# Altium schematic sheet Power subsystem.SchDoc
size A; SheetNumber: 2; SheetTotal: 2
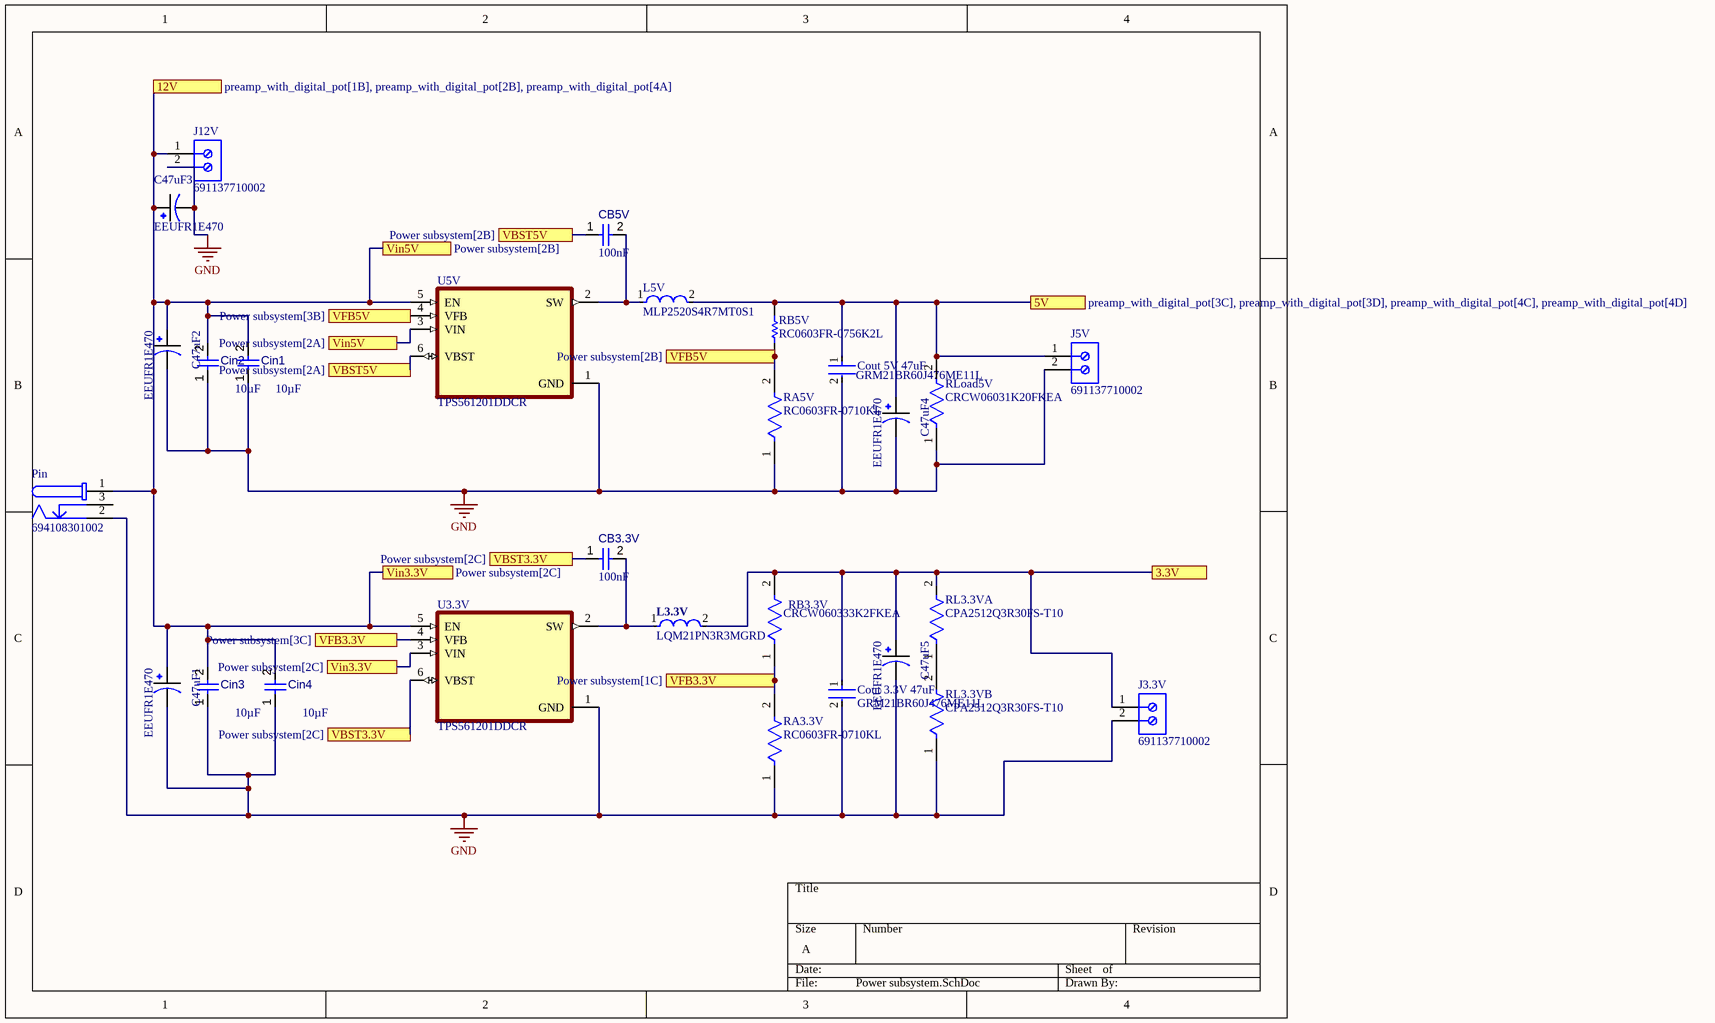
[diagram p0: Power subsystem.SchDoc]

## Parts
C47uF1  EEUFR1E470  [*CAPPRD200W50D500H1100_EEUFR1E470(Primary)]
C47uF2  EEUFR1E470  [*CAPPRD200W50D500H1100_EEUFR1E470(Primary)]
C47uF3  EEUFR1E470  [*CAPPRD200W50D500H1100_EEUFR1E470(Primary)]
C47uF4  EEUFR1E470  [*CAPPRD200W50D500H1100_EEUFR1E470(Primary)]
C47uF5  EEUFR1E470  [*CAPPRD200W50D500H1100_EEUFR1E470(Primary)]
CB3.3V  value 100nF  [CAPC1608X90X40NL10T20]  (hidden comment: Capacitor 100 nF +/-10% 50 V 0603)
CB5V  value 100nF  [CAPC1608X90X40NL10T20]  (hidden comment: Capacitor 100 nF +/-10% 50 V 0603)
Cin1  value 10µF  [CAPC0805(2012)145_L]  (hidden comment: Capacitor 10µF +/-20% 25V 0805)
Cin2  value 10µF  [CAPC0805(2012)145_L]  (hidden comment: Capacitor 10µF +/-20% 25V 0805)
Cin3  value 10µF  [CAPC0805(2012)145_L]  (hidden comment: Capacitor 10µF +/-20% 25V 0805)
Cin4  value 10µF  [CAPC0805(2012)145_L]  (hidden comment: Capacitor 10µF +/-20% 25V 0805)
Cout_3.3V_47uF  GRM21BR60J476ME11L  [FP-GRM21B-0_2-e0_2_0_7-IPC_B]
Cout_5V_47uF  GRM21BR60J476ME11L  [FP-GRM21B-0_2-e0_2_0_7-IPC_B]
J3.3V  691137710002  [691137710002]
J5V  691137710002  [691137710002]
J12V  691137710002  [691137710002]
L3.3V  LQM21PN3R3MGRD  [FP-LQM21PH_G0-MFG]
L5V  MLP2520S4R7MT0S1  [FP-MLP2520M-IPC_C]
Pin  694108301002  [694108301002]
RA3.3V  RC0603FR-0710KL  [FP-RC0603-0_55-IPC_C]
RA5V  RC0603FR-0710KL  [FP-RC0603-0_55-IPC_C]
RB3.3V  CRCW060333K2FKEA  [FP-CRCW0603-e3-IPC_B]
RB5V  RC0603FR-0756K2L  [RESC1608X55X25LL10T15]
RL3.3VA  CPA2512Q3R30FS-T10  [FP-CPA2512-MFG]
RL3.3VB  CPA2512Q3R30FS-T10  [FP-CPA2512-MFG]
RLoad5V  CRCW06031K20FKEA  [FP-CRCW0603-e3-MFG]
U3.3V  TPS561201DDCR  [SOT95P280X110-6N]
U5V  TPS561201DDCR  [SOT95P280X110-6N]

## Ports
3.3V, 5V (see preamp_with_digital_pot[3C], preamp_with_digital_pot[3D], preamp_with_digital_pot[4C], preamp_with_digital_pot[4D]), 12V (see preamp_with_digital_pot[1B], preamp_with_digital_pot[2B], preamp_with_digital_pot[4A]), VBST3.3V (see Power subsystem[2C]), VBST5V (see Power subsystem[2A]), VBST5V (see Power subsystem[2B]), VFB3.3V (see Power subsystem[1C]), VFB3.3V (see Power subsystem[3C]), VFB5V (see Power subsystem[2B]), VFB5V (see Power subsystem[3B]), Vin3.3V (see Power subsystem[2C]), Vin5V (see Power subsystem[2A]), Vin5V (see Power subsystem[2B])

## Nets
GND: C47uF1.N C47uF2.N C47uF3.N C47uF4.N C47uF5.N Cin1.1 Cin2.1 Cin3.1 Cin4.1 Cout_3.3V_47uF.2 Cout_5V_47uF.2 J3.3V.2 J5V.2 J12V.2 Pin.2 RA3.3V.1 RA5V.1 RL3.3VB.1 RLoad5V.1 U3.3V.1(GND) U5V.1(GND)
3.3V: C47uF5.P Cout_3.3V_47uF.1 J3.3V.1 L3.3V.2 RB3.3V.2 RL3.3VA.2 ; port 3.3V
5V: C47uF4.P Cout_5V_47uF.1 J5V.1 L5V.2 RB5V.2 RLoad5V.2 ; port 5V
12V: C47uF1.P C47uF2.P C47uF3.P Cin1.2 Cin2.2 Cin3.2 Cin4.2 J12V.1 Pin.1 U3.3V.3(VIN) U3.3V.5(EN) U5V.3(VIN) U5V.5(EN) ; port Vin5V, port Vin3.3V, port 12V
VBST3.3V: CB3.3V.1 U3.3V.6(VBST) ; port VBST3.3V
VBST5V: CB5V.1 U5V.6(VBST) ; port VBST5V
VFB3.3V: RA3.3V.2 RB3.3V.1 U3.3V.4(VFB) ; port VFB3.3V
VFB5V: RA5V.2 RB5V.1 U5V.4(VFB) ; port VFB5V
NetCB3.3V_2: CB3.3V.2 L3.3V.1 U3.3V.2(SW)
NetCB5V_2: CB5V.2 L5V.1 U5V.2(SW)
NetRL3.3VA_1: RL3.3VA.1 RL3.3VB.2

Not connected (* = marked no-connect by the designer): Pin 3

## Library data of the parts
CB3.3V CB5V = CMP-001-00017-6: Chip Capacitor, 100 nF, +/- 10%, 50 V, 0603 (1608 Metric); Voltage Rating: 50V; Capacitor Type: Ceramic; Tolerance: 10%; Mounting Technology: SM; Max Operating Temperature: 125°C; RoHS Compliant: True; Pins: 2; Case/Package: 0603; Min Operating Temperature: -55°C
Cin1-Cin4 = CMP-001-00079-4: Chip Capacitor, 10µF +/-20%, 25V, 0805, Thickness 1.45 mm; Tolerance: 10%; Max Operating Temperature: 85°C; Case/Package: 0805; Voltage Rating: 25V; Min Operating Temperature: -55°C; Mounting Technology: SMT; Pins: 2
Cout_3.3V_47uF Cout_5V_47uF = CMP-06035-028650-1: Chip Multilayer Ceramic Capacitors for General Purpose, 0805, 47uF, X5R, 15%, 20%, 6.3V; Tolerance: 20%; Case/Package: 0805; Length: 2mm; Thickness: 1.25mm; Dielectric: X5R; Width: 1.25mm; Capacitance: 47uF; Voltage Rating (DC): 6.3V
J3.3V J5V J12V = CMP-1502-03324-2: NexarPartId: 78871135; Voltage Rating: 300V; Number of Contacts: 2; Current Rating: 16A; Lead Pitch: 5mm; Height: 11.6mm; Packaging: Box; RoHS: Non-Compliant; Contact Material: Nickel, Tin; Max Operating Temperature: 120°C; Number of Pins: 2; Min Operating Temperature: -30°C; Number of Rows: 1
L3.3V = CMP-06042-017013-1: Multilayer Type Inductor for Power Lines, 0805 (2012), 3.3μH, 20%, 0.188Ω, 1.0A; Current Rating: 1A; DC Resistance (DCR): 188mR; Core Material: Ferrite; Shielding: Shielded; Self Resonant Frequency: 30MHz; Test Frequency: 1MHz; Inductance: 3.3uH; Max Operating Temperature: 125°C; Tolerance: 20%; Mount: Surface Mount; RoHS Compliant: Yes; Package Quantity: 4000; Height - Seated (Max): 0.039inch; Length: 0.079inch; Width: 0.049inch; Case/Package: 0805; Packaging: Tape and Reel; Min Operating Temperature: -55°C
L5V = CMP-08253-000319-1: Shielded Multilayer Inductor 4.7uH ±20% 1000mA 169mΩ SMD 1008; Test Frequency: 2MHz; DC Resistance (DCR): 169mR; Core Material: Ferrite; Current Rating: 1A; Max Operating Temperature: 125°C; Packaging: Tape and Reel; Length: 0.098inch; Shielding: Shielded; Height - Seated (Max): 0.039inch; Case Code (Imperial): 1008; Tolerance: 20%; Width: 0.079inch; Package Quantity: 3000; Case/Package: 1008; Case Code (Metric): 2520; RoHS Compliant: Yes; Mount: Surface Mount; Inductance: 4.7uH; Min Operating Temperature: -40°C
Pin = CMP-1502-00190-3: NexarPartId: 52676102; Gender: Male; Voltage Rating: 24V; Insulation Resistance: 100MΩ; Voltage Rating (DC): 20V; Shielding: Unshielded; Connector Type: Power; Current Rating: 5A; Number of Contacts: 3; Packaging: Bulk; Operating Supply Voltage: 24V; Flammability Rating: UL94 V-0; Housing Material: Polyamide; Color: Black; REACH SVHC: Unknown; Contact Material: Gold, Tin; Max Operating Temperature: 85°C; Contact Gender: Female; Contact Plating: Tin; Termination: Through Hole; Min Operating Temperature: -40°C; RoHS: Compliant; Height: 11mm; Mount: Through Hole
RA3.3V RA5V = CMP-2100-03664-2: RES 10K OHM 1% 1/10W 0603; Voltage Rating: 75V; Voltage Rating (DC): 50V; Resistance: 10kR; Power Rating: 100mW; Temperature Coefficient: 100ppm/°C; Depth: 0.8mm; Termination: SMD/SMT; Resistor Type: Thick Film; Series: RC; Construction: Rectangular; Features: Moisture Resistant; Packaging: Tape and Reel; Min Operating Temperature: -55°C; Number of Terminations: 2; Lead Pitch: 0.3mm; RoHS Compliant: Yes; Case/Package: 0603; Resistance Tolerance: 1%; Military Standard: Not; Weight: 7.1E-05oz; Number of Pins: 2; Tolerance: 1%; Length: 1.6mm; Case Code (Imperial): 0603; Lead Free: Lead Free; Width: 0.8mm; Max Power Dissipation: 100mW; Height: 0.45mm; Max Operating Temperature: 155°C; Case Code (Metric): 1608; Size Code: 0603
RB3.3V = CMP-2000-03248-2: RES Thick Film, 33.2kΩ, 1%, 0.1W, 100ppm/°C, 0603; Voltage Rating (DC): 75V; Max Power Dissipation: 100mW; Resistance: 33.2kR; Package Quantity: 5000; Max Operating Temperature: 155°C; Height: 0.45mm; Radiation Hardening: No; Width: 0.85mm; Termination: SMD/SMT; Weight: 7.1E-05oz; Number of Terminations: 2; Case Code (Imperial): 0603; Military Standard: Not; Temperature Coefficient: 100ppm/°C; Case/Package: 0603; Length: 1.55mm; Packaging: Tape and Reel; Number of Pins: 2; Lead Free: Lead Free; Composition: Thick Film; Case Code (Metric): 1608; Tolerance: 1%; Min Operating Temperature: -55°C; Voltage Rating: 75V; Depth: 0.85mm; Mount: Surface Mount; Contact Plating: Tin; Power Rating: 100mW; Features: Automotive AEC-Q200
RB5V = CMP-1659-00050-1: Chip Resistor, 56.2 KOhm, +/- 1%, 0.1 W, -55 to 155 degC, 0603 (1608 Metric), RoHS, Tape and Reel; Gender: Female; Connector Type: USB; Voltage Rating: 30 V; Current Rating: 1 A; Packaging: Tray; Package Quantity: 24000; PackageDescription: 2-Pin Surface Mount Device, Body 1.6 x 0.8 mm; DatasheetVersion: Rev. 4, 02/2016; PackageReference: 0603; Length: 14.5 mm; Contact Material: Copper; ComponentLink2Description: Datasheet; Radiation Hardening: No; Max Operating Temperature: 50 degC; Width: 7.12 mm; RoHSCompliant: true; Contact Plating: Gold; Pins: 4; Colour: Black; ComponentLink1Description: Manufacturer URL; Min Operating Temperature: 0 degC; ComponentLink2URL: http://www.yageo.com/documents/recent/PYu-RC_Group_51_RoHS_L_04.pdf; Height: 15 mm; ComponentLink1URL: http://www.yageo.com/; Mount: Through Hole; REACH SVHC: Unknown
RL3.3VA RL3.3VB = CMP-00597-19168341-1: CPA2512Q3R30FS-T10 CPA Series 2512 16 W 3.3O ±1% ±50 ppm/°C SMT Thin Film Chip Power Resistor; Max Power Dissipation: 16W; Resistance: 3.3Ω; Max Operating Temperature: 155°C; Features: Moisture Resistant; NexarPartId: 19168341; Composition: Thin Film; Power Rating: 16W; Width: 3.2mm; Packaging: Cut Tape (CT); Temperature Coefficient: 50ppm/°C; Height: 787.4µm; Number of Terminations: 2; Lifecycle Status: Production; Case Code (Metric): 6432; Length: 6.2992mm; Lead Free: Lead Free; Case/Package: 2512; RoHS: Compliant; Case Code (Imperial): 2512; Tolerance: 1%; Min Operating Temperature: -55°C
RLoad5V = CMP-2000-02982-2: RES Thick Film, 1.2kΩ, 1%, 0.1W, 100ppm/°C, 0603; Max Power Dissipation: 100mW; Resistance: 1.2kR; Voltage Rating: 75V; Package Quantity: 10; Weight: 7.1E-05oz; Packaging: Tape and Reel; Max Operating Temperature: 155°C; Case/Package: 0603; Case Code (Imperial): 0603; Length: 1.55mm; Width: 0.033inch; Radiation Hardening: No; Power Rating: 100mW; Depth: 0.85mm; Military Standard: Not; Case Code (Metric): 1608; Tolerance: 1%; Termination: SMD/SMT; Temperature Coefficient: 100ppm/°C; Mount: Surface Mount; Min Operating Temperature: -55°C; Lead Free: Lead Free; Contact Plating: Tin; Composition: Thick Film; Voltage Rating (DC): 75V; Features: Automotive AEC-Q200; Height: 0.45mm; Number of Terminations: 2
U3.3V U5V = CMP-003-000000-1: 4.5V to 17V Input, 1A Synchronous Step-Down Voltage Regulator in 6-pin SOT-23; MF: Texas Instruments; Source: TPS561201DDCR.SchLib; Package: SOT-23-THN-6 Texas Instruments; Component Type: Standard; Pin Count: 6; Value: *; Check_prices: https://www.snapeda.com/parts/TPS561201DDCR/Texas+Instruments/view-part/?ref=eda; Design Item ID: TPS561201DDCR; MP: TPS561201DDCR; SnapEDA_Link: https://www.snapeda.com/parts/TPS561201DDCR/Texas+Instruments/view-part/?ref=snap
C47uF1-C47uF5 = EEUFR1E470: Value: *